# Altium project eBox_4G_SIM7600.PrjPcb
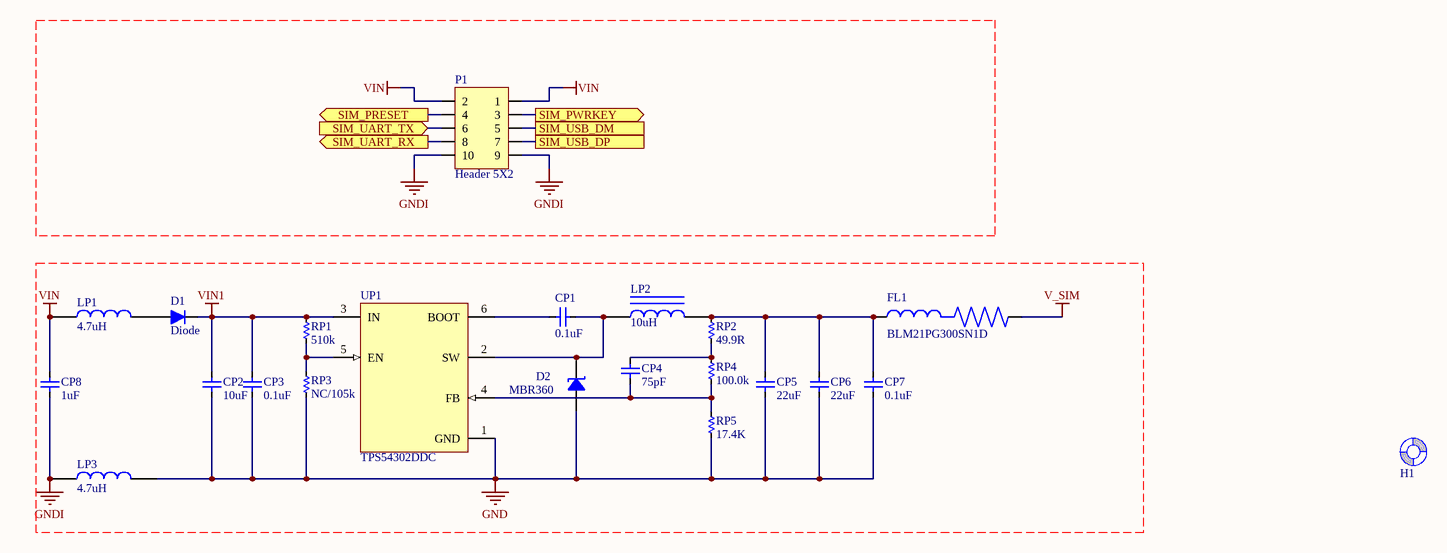
[diagram p0: eBox_4G_REG.schdoc]
Version: 2.1; Hash: R942R9Z6
2 sheets, 81 parts. Net scope: flat (ports and power ports of the same name join across sheets).
Board file: eBox_4G_SIM7600.PcbDoc
Sheets:
  eBox_4G_REG.schdoc
  eBox_4G_SIM.SchDoc

## Sheet eBox_4G_REG.schdoc: car_logger_fona_reg
size A4; DocumentNumber: 3; SheetNumber: 3; SheetTotal: 3

### Parts
CP1  0.1uF  [CC 0603]
CP2  10uF  [CC 0805]
CP3  0.1uF  [CC 0603]
CP4  75pF  [CC 0603]
CP5  22uF  [CC 0805]
CP6  22uF  [CC 0805]
CP7  0.1uF  [CC 0603]
CP8  1uF  [CC 0805]
D1  Diode  [DO-214AC (SMA) L]
D2  MBR360  [SMF DO-219AB]
FL1  BLM21PG300SN1D  [L 0805 (2012)]
H1  Screw Hole  [SCREW/2.8M/5M]  (value not drawn)  (no BOM)
LP1  4.7uH  [0805]
LP2  10uH  [IND_MWSA0518_525418]
LP3  4.7uH  [0805]
P1  Header 5X2  [HDR/Header/10/DL]
RP1  510k  [RR 0603]
RP2  49.9R  [RR 0603]
RP3  NC/105k  [RR 0603]
RP4  100.0k  [RR 0603]
RP5  17.4K  [RR 0603]
UP1  TPS54302DDC  [SOT-23-6]

### Ports
SIM_PRESET (out), SIM_PWRKEY (out), SIM_UART_RX (out), SIM_UART_TX (in), SIM_USB_DM, SIM_USB_DP

### Nets
GND: CP2.2 CP3.2 CP5.2 CP6.2 CP7.2 D2.1 LP3.2 RP3.1 RP5.2 UP1.1(GND)
GNDI: CP8.2 LP3.1 P1.9 P1.10
V_SIM: FL1.2
VIN: CP8.1 LP1.1 P1.1 P1.2
VIN1: CP2.1 CP3.1 D1.2(K) RP1.2 UP1.3(IN)
SIM_PRESET: P1.4 ; port SIM_PRESET
SIM_PWRKEY: P1.3 ; port SIM_PWRKEY
SIM_UART_RX: P1.8 ; port SIM_UART_RX
SIM_UART_TX: P1.6 ; port SIM_UART_TX
SIM_USB_DM: P1.5 ; port SIM_USB_DM
SIM_USB_DP: P1.7 ; port SIM_USB_DP
NetCP1_1: CP1.1 UP1.6(BOOT)
NetCP1_2: CP1.2 D2.2 LP2.1 UP1.2(SW)
NetCP4_1: CP4.1 RP2.2 RP4.1
NetCP4_2: CP4.2 RP4.2 RP5.1 UP1.4(FB)
NetCP5_1: CP5.1 CP6.1 CP7.1 FL1.1 LP2.2 RP2.1
NetD1_1: D1.1(A) LP1.2
NetRP1_1: RP1.1 RP3.2 UP1.5(EN)

Not connected (* = marked no-connect by the designer): H1 1(Screw)

### Notes on the sheet
- Title
- Size:
- Date:
- A4
- Number:
- Time:
- Revision:
- Sheet
- of
- NPN
- Lab
- File:

### Library data of the parts
CP1 CP3 CP7 = Capacitor NP: CAP CER 0.1UF 16V X7R 0603; Manufacturer: Murata Electronics; Manufacturer Part Number: GCJ188R71C104KA01D; Supplier 1: Digi-Key; Supplier Part Number 1: 490-5796-2-ND; Termination Style: SMD/SMT; Package: 0603 (1608 Metric)
CP2 CP8 = Capacitor NP: CAP CER 10UF 25V X5R 0805; Manufacturer: Murata Electronics; Manufacturer Part Number: GRM21BR61E106MA73L; Supplier 1: Digi-Key; Supplier Part Number 1: 490-10748-2-ND; Termination Style: SMD/SMT; Package: 0805 (2012 Metric)
CP4 = Capacitor NP: CAP CER 75PF 50V C0G/NP0 0603; Manufacturer: Murata Electronics; Manufacturer Part Number: GRM1885C1H750JA01D; Supplier 1: Digi-Key; Supplier Part Number 1: 490-1424-1-ND; Termination Style: SMD/SMT; Package: 0603 (1608 Metric)
CP5 CP6 = Capacitor NP: CAP CER 22UF 25V X5R 0805; Manufacturer: Murata Electronics; Manufacturer Part Number: GRM21BR61E226ME44L; Supplier 1: Digi-Key; Supplier Part Number 1: 490-10749-2-ND; Termination Style: SMD/SMT; Package: 0805 (2012 Metric)
D1 = Diode: Default Diode
D2 = VTVS58ASMF-HM3-08: TVS DIODE 57.6V 98V DO219AB; Manufacturer: Vishay Semiconductor Diodes Division; Capacitance @ Frequency: 245pF @ 1MHz; Current - Peak Pulse (10/1000µs): 3.89A; Power Line Protection: No; Power - Peak Pulse: 400W; Type: DO-219AB; Unidirectional Channels: 1; Voltage - Breakdown (Min): 64.6V; Part Number: VTVS58ASMF-HM3-08; Applications: Automotive; ComponentLink1Description: Datasheet; ComponentLink1URL: http://www.vishay.com/docs/85891/vtvs3v3asmf.pdf; ComponentLink2Description: DigiKey Link; ComponentLink2URL: http://digikey.com/product-detail/en/vishay-semiconductor-diodes-division/VTVS58ASMF-HM3-08/112-VTVS58ASMF-HM3-08CT-ND/11562600; Device Package: DO-219AB; LastUpdated: 3/21/2020 12:56:09 AM; Lifecycle Status: Active; Minimum Order: 0; Mounting Type: Surface Mount; Operating Temperature: -55°C ~ 175°C (TJ); Package / Case: DO-219AB; Packaging: TapeAndReel; PartId: 5476; Part Status: -55°C ~ 175°C (TJ); Price: 0.10; Series: Automotive, AEC-Q101, TransZorb®; Supplier 1: DigiKey; Supplier Part Number 1: 112-VTVS58ASMF-HM3-08CT-ND; Supplier Device Package: DO-219AB (SMF); Voltage - Clamping (Max) @ Ipp: 98V; Voltage - Reverse Standoff (Typ): 57.6V
FL1 = BLM21PG300SN1D: 30 Ohms @ 100MHz 1 Power Line Ferrite Bead 0805 _2012 Metric_ 4A 14mOhm; MF: Murata; Value: *; MP: BLM21PG300SN1D; Package: 2012 Murata; SnapEDA_Link: https://www.snapeda.com/parts/BLM21PG300SN1D/Murata/view-part/214335/?ref=snap; Digi-Key_Part_Number: 490-1052-1-ND; Digi-Key_Purchase_URL: https://www.digikey.com/product-detail/en/murata-electronics/BLM21PG300SN1D/490-1052-1-ND/584499?utm_source=snapeda&utm_medium=aggregator&utm_campaign=symbol
LP1 LP3 = Inductor: Manufacturer: *; Manufacturer Part No: *; Component Type: Inductor; Value: *; Order Code: *; Supplier: *
LP2 = Inductor Power: Fixed Inductors 10uH 20% Low Profile; Manufacturer: Sunlord; Manufacturer Part Number: MWSA0518-100MT; Termination Style: SMD/SMT; Package: 5254
P1 = Header 5X2: Header, 5-Pin, Dual row
RP1 = Resistors: RES SMD 510K OHM 1% 1/10W 0603; Manufacturer: Panasonic Industrial Devices; Manufacturer Part Number: ERJ-3EKF5103V; Supplier 1: Digi-Key; Supplier Part Number 1: P510KHCT-ND; Termination Style: SMD/SMT; Package: 0603 (1608 Metric)
RP2 = Resistors: RES SMD 49.9 OHM 1% 1/10W 0603; Manufacturer: Panasonic Industrial Devices; Manufacturer Part Number: ERJ-3EKF49R9V; Supplier 1: Digi-Key; Supplier Part Number 1: P49.9HTR-ND; Termination Style: SMD/SMT; Package: 0603 (1608 Metric)
RP3 = Resistors: RES SMD 105K OHM 1% 1/10W 0603; Manufacturer: Panasonic Industrial Devices; Manufacturer Part Number: ERJ-3EKF1053V; Supplier 1: Digi-Key; Supplier Part Number 1: P105KHCT-ND; Termination Style: SMD/SMT; Package: 0603 (1608 Metric)
RP4 = Resistors: RES SMD 100K OHM 1% 1/10W 0603; Manufacturer: Panasonic Industrial Devices; Manufacturer Part Number: ERJ-3EKF1003V; Supplier 1: Digi-Key; Supplier Part Number 1: P100KHCT-ND; Termination Style: SMD/SMT; Package: 0603 (1608 Metric)
RP5 = Resistors: RES SMD 17.4K OHM 1% 1/10W 0603; Manufacturer: Panasonic Industrial Devices; Manufacturer Part Number: ERJ-3EKF1742V; Supplier 1: Digi-Key; Supplier Part Number 1: P17.4KHTR-ND; Termination Style: SMD/SMT; Package: 0603 (1608 Metric)
UP1 = TPS56339: IC REG BUCK ADJ 3A TSOT23-6; Manufacturer: Texas Instruments; Manufacturer Part Number: TPS54302DDCR; Package: SOT-23-6; Supplier 1: Digi-Key; Supplier Part Number 1: 296-46237-1-ND; Termination Style: SMD/SMT

## Sheet eBox_4G_SIM.SchDoc
size B
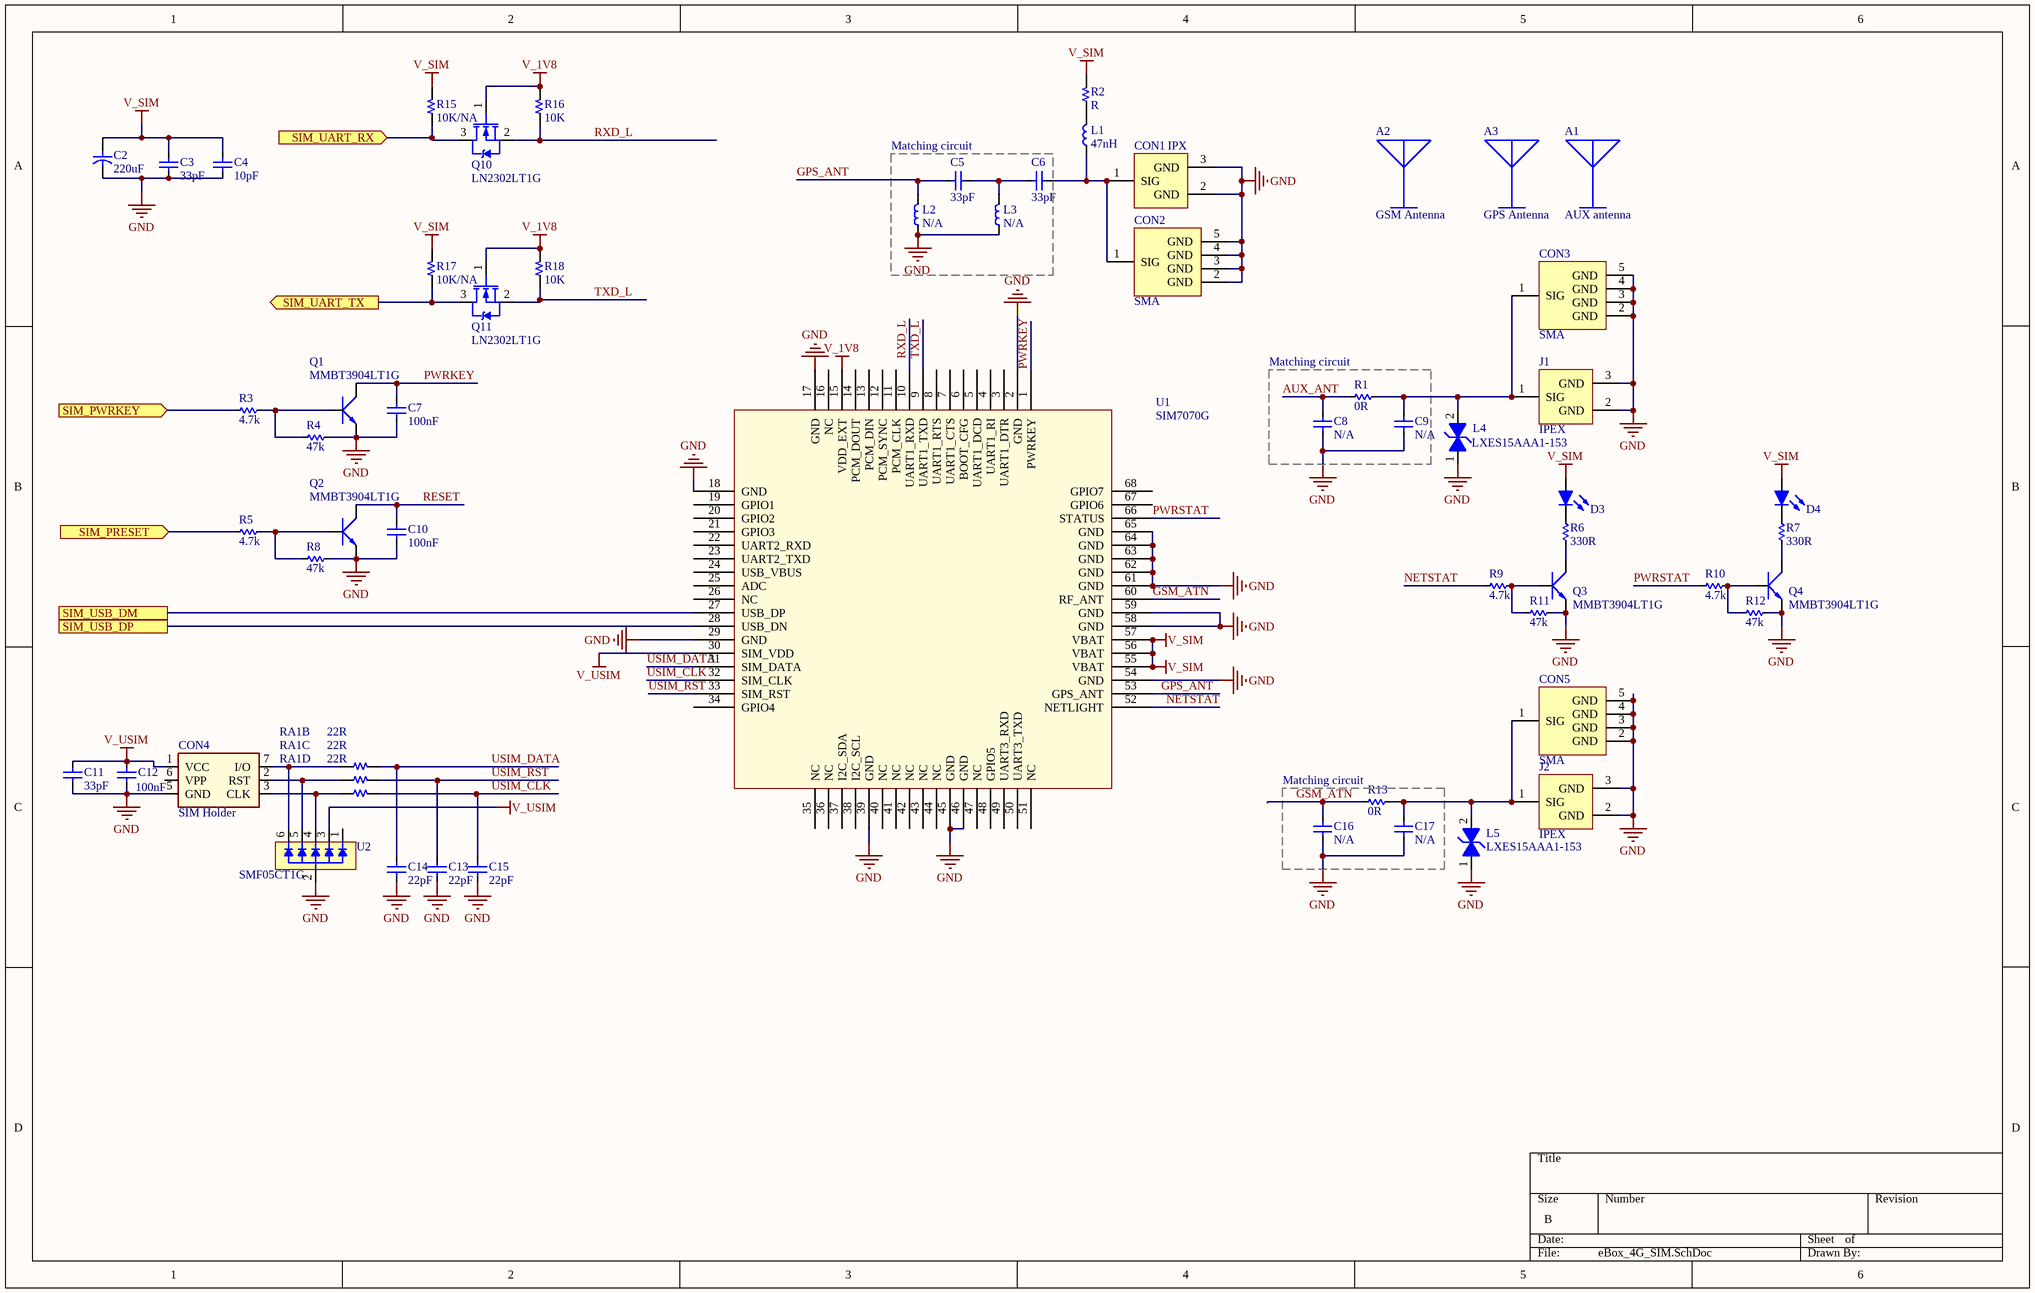
[diagram p1: eBox_4G_SIM.SchDoc]

### Parts
A1  AUX antenna  [Antenna]
A2  GSM Antenna  [Antenna]
A3  GPS Antenna  [Antenna]
C2  220uF  [C SMD ALU (D8)]
C3  33pF  [CC 0603]
C4  10pF  [CC 0603]
C5  33pF  [CC 0603]
C6  33pF  [CC 0603]
C7  100nF  [CC 0603]
C8  N/A  [CC 0603]
C9  N/A  [CC 0603]
C10  100nF  [CC 0603]
C11  33pF  [CC 0603]
C12  100nF  [CC 0603]
C13  22pF  [CC 0603]
C14  22pF  [CC 0603]
C15  22pF  [CC 0603]
C16  N/A  [CC 0603]
C17  N/A  [CC 0603]
CON1  IPX  [CONN/IPX/SMD]
CON2  SMA  [CONN/SMA/RA]
CON3  SMA  [CONN/SMA/RA]
CON4  SIM Holder  [CON SIM Holder C707]
CON5  SMA  [CONN/SMA/RA]
D3  LED GREEN  [Led 0603 - green]  (value not drawn)
D4  LED RED  [Led 0603 - red]  (value not drawn)
J1  IPEX  [CONN/IPX/SMD]
J2  IPEX  [CONN/IPX/SMD]
L1  47nH  [L 0603 (1608)]
L2  N/A  [LL 0603]
L3  N/A  [LL 0603]
L4  LXES15AAA1-153  [C 0603]
L5  LXES15AAA1-153  [C 0603]
Q1  MMBT3904LT1G  [SOT-23]
Q2  MMBT3904LT1G  [SOT-23]
Q3  MMBT3904LT1G  [SOT-23]
Q4  MMBT3904LT1G  [SOT-23]
Q10  LN2302LT1G  [SOT-23]
Q11  LN2302LT1G  [SOT-23]
R1  0R  [RR 0603]
R2  R  [R 0603]
R3  4.7k  [RR 0603]
R4  47k  [RR 0603]
R5  4.7k  [RR 0603]
R6  330R  [RR 0603]
R7  330R  [RR 0603]
R8  47k  [RR 0603]
R9  4.7k  [RR 0603]
R10  4.7k  [RR 0603]
R11  47k  [RR 0603]
R12  47k  [RR 0603]
R13  0R  [RR 0603]
R15  10K/NA  [R 0603]
R16  10K  [R 0603]
R17  10K/NA  [R 0603]
R18  10K  [R 0603]
RA1  22R  [RAx4 1206 (3216)]  (parts B,C,D of 4)
U1  SIM7070G  [SIM7070]
U2  SMF05CT1G  [SOT-363-6]

### Blocks framed on the sheet
Matching circuit: C5 C6 L2 L3
Matching circuit: C8 C9 R1
Matching circuit: C16 C17 R13

### Ports
SIM_PRESET (in), SIM_PWRKEY (in), SIM_UART_RX (in), SIM_UART_TX (out), SIM_USB_DM, SIM_USB_DP

### Nets
GND: C2.2 C3.1 C4.1 C7.2 C8.1 C9.1 C10.2 C11.2 C12.2 C13.2 C14.2 C15.2 C16.1 C17.1 CON1.2(GND) CON1.3(GND) CON2.2(GND) CON2.3(GND) CON2.4(GND) CON2.5(GND) CON3.2(GND) CON3.3(GND) CON3.4(GND) CON3.5(GND) CON4.5(GND) CON5.2(GND) CON5.3(GND) CON5.4(GND) CON5.5(GND) J1.2(GND) J1.3(GND) J2.2(GND) J2.3(GND) L2.1 L3.1 L4.1 L5.1 Q1.2(E) Q2.2(E) Q3.2(E) Q4.2(E) R4.2 R8.2 R11.2 R12.2 U1.2(GND) U1.17(GND) U1.18(GND) U1.29(GND) U1.39(GND) U1.45(GND) U1.46(GND) U1.54(GND) U1.58(GND) U1.59(GND) U1.61(GND) U1.62(GND) U1.63(GND) U1.64(GND) U1.65(GND) U2.2(A)
V_1V8: Q10.1(G) Q11.1(G) R16.2 R18.2 U1.15(VDD_EXT)
V_SIM: C2.1 C3.2 C4.2 D3.1(A) D4.1(A) R2.2 R15.2 R17.2 U1.55(VBAT) U1.56(VBAT) U1.57(VBAT)
V_USIM: C11.1 C12.1 CON4.1(VCC) U1.30(SIM_VDD) U2.3(K3)
AUX_ANT: C8.2 R1.2
GPS_ANT: C5.2 L2.2 U1.53(GPS_ANT)
GSM_ATN: C16.2 R13.2 U1.60(RF_ANT)
NETSTAT: R9.1 U1.52(NETLIGHT)
PWRKEY: C7.1 Q1.3(C) U1.1(PWRKEY)
PWRSTAT: R10.1 U1.66(STATUS)
RESET: C10.1 Q2.3(C)
RXD_L: Q10.2(S) R16.1 U1.10(UART1_RXD)
SIM_PRESET: R5.1 ; port SIM_PRESET
SIM_PWRKEY: R3.1 ; port SIM_PWRKEY
SIM_UART_RX: Q10.3(D) R15.1 ; port SIM_UART_RX
SIM_UART_TX: Q11.3(D) R17.1 ; port SIM_UART_TX
SIM_USB_DM: U1.27(USB_DP) ; port SIM_USB_DM
SIM_USB_DP: U1.28(USB_DN) ; port SIM_USB_DP
TXD_L: Q11.2(S) R18.1 U1.9(UART1_TXD)
USIM_CLK: C15.1 RA1.5 U1.32(SIM_CLK)
USIM_DATA: C14.1 RA1.7 U1.31(SIM_DATA)
USIM_RST: C13.1 RA1.6 U1.33(SIM_RST)
NetC5_1: C5.1 C6.2 L3.2
NetC6_1: C6.1 CON1.1(SIG) CON2.1(SIG) L1.1
NetC9_2: C9.2 CON3.1(SIG) J1.1(SIG) L4.2 R1.1
NetC17_2: C17.2 CON5.1(SIG) J2.1(SIG) L5.2 R13.1
NetCON4_2: CON4.2(RST) RA1.3 U2.5(K5)
NetCON4_3: CON4.3(CLK) RA1.4 U2.4(K4)
NetCON4_7: CON4.7(I/O) RA1.2 U2.6(K6)
NetD3_2: D3.2(K) R6.2
NetD4_2: D4.2(K) R7.2
NetL1_2: L1.2 R2.1
NetQ1_1: Q1.1(B) R3.2 R4.1
NetQ2_1: Q2.1(B) R5.2 R8.1
NetQ3_1: Q3.1(B) R9.2 R11.1
NetQ3_3: Q3.3(C) R6.1
NetQ4_1: Q4.1(B) R10.2 R12.1
NetQ4_3: Q4.3(C) R7.1

Not connected (* = marked no-connect by the designer): CON4 6(VPP); U1 3(UART1_DTR) 4(UART1_RI) 5(UART1_DCD) 6(BOOT_CFG) 7(UART1_CTS) 8(UART1_RTS) 11(PCM_CLK) 12(PCM_SYNC) 13(PCM_DIN) 14(PCM_DOUT) 16(NC) 19(GPIO1) 20(GPIO2) 21(GPIO3) 22(UART2_RXD) 23(UART2_TXD) 24(USB_VBUS) 25(ADC) 26(NC) 34(GPIO4) 35(NC) 36(NC) 37(I2C_SDA) 38(I2C_SCL) 40(NC) 41(NC) 42(NC) 43(NC) 44(NC) 47(NC) 48(GPIO5) 49(UART3_RXD) 50(UART3_TXD) 51(NC) 67(GPIO6) 68(GPIO7); U2 1(K1)

### Library data of the parts
A1-A3 = Antenna
C2 = Capacitor: CAP TANT POLY 100UF 6.3V 1210; Manufacturer: AVX Corporation; Manufacturer Part Number: TCJB107M006R0055; Package: 1210 (3528 Metric); Supplier 1: Digi-Key; Supplier Part Number 1: 478-9410-2-ND; Termination Style: SMD/SMT
C3 C5 C6 C11 C13-C15 = Capacitor NP: CAP CER 33PF 100V C0G/NP0 0603; Manufacturer: Murata Electronics; Manufacturer Part Number: GCM1885C2A330JA16D; Supplier 1: Digi-Key; Supplier Part Number 1: 490-4943-2-ND; Termination Style: SMD/SMT; Package: 0603 (1608 Metric)
C4 = Capacitor NP: CAP CER 10PF 100V C0G/NP0 0603; Manufacturer: Murata Electronics; Manufacturer Part Number: GCM1885C2A100JA16D; Supplier 1: Digi-Key; Supplier Part Number 1: 490-4770-2-ND; Termination Style: SMD/SMT; Package: 0603 (1608 Metric)
C7 C10 C12 = Capacitor NP: as CP1 on sheet eBox_4G_REG; Supplier 1: Digi-Key; Supplier Part Number 1: 490-5796-2-ND; Termination Style: SMD/SMT; Package: 0603 (1608 Metric)
C8 C9 C16 C17 = Capacitor NP: CAP N/A; Supplier 1: Digi-Key; Termination Style: SMD/SMT; Package: 0603 (1608 Metric)
CON1 = CON IPX
CON2 CON3 CON5 = CON SMA: SMA connectors
CON4 = SIM holder 6 pin: SIM Card holder, 6 pins
D3 = Led: LED GREEN DIFFUSED 0603 SMD; Manufacturer: Rohm Semiconductor; Manufacturer Part Number: SML-D12P8WT86; Package: 0603 (1608 Metric); Supplier 1: Digi-Key; Supplier Part Number 1: 511-1579-2-ND; Termination Style: SMD/SMT
D4 = Led: LED RED DIFFUSED 0603 SMD; Manufacturer: Rohm Semiconductor; Manufacturer Part Number: SML-D12U8WT86; Package: 0603 (1608 Metric); Supplier 1: Digi-Key; Supplier Part Number 1: 511-1580-2-ND; Termination Style: SMD/SMT
J1 J2 = CON IPX: CONN UMC RCPT STR 50 OHM SMD; Manufacturer: Taoglas Limited; Manufacturer Part Number: RECE.20279.001E.01; Supplier 1: Digi-Key; Supplier Part Number 1: 931-1107-1-ND; Termination Style: SMD/SMT
L1 = Inductor
L2 L3 = Inductor: IND N/A; Supplier 1: Digi-Key; Termination Style: SMD/SMT; Package: 0603 (1608 Metric)
L4 L5 = LXES15AAA1-153: Clamp Ipp Tvs Diode Surface Mount 1005; MF: Murata; SnapEDA_Link: https://www.snapeda.com/parts/LXES15AAA1-153/Murata%20Electronics%20North%20America/view-part/653473/?ref=snap; MP: LXES15AAA1-153; Value: *; Digi-Key_Part_Number: 490-13210-1-ND; Digi-Key_Purchase_URL: https://www.digikey.kr/product-detail/en/murata-electronics/LXES15AAA1-153/490-13210-1-ND/5843764?utm_source=snapeda&utm_medium=aggregator&utm_campaign=symbol; Package: 0402 Murata
Q1-Q4 = MMBT3904LT1G: TRANS NPN 40V 0.2A SOT23; Manufacturer: ON Semiconductor; Supplier 1: Digi-Key; Supplier Part Number 1: MMBT3904LT1GOSCT-ND; Manufacturer Part Number: MMBT3904LT1G; Package: SOT-23-3 (TO-236); Termination Style: SMD/SMT
Q10 Q11 = Mosfet N
R1 R13 = Resistors: RES SMD 0 OHM JUMPER 1/10W 0603; Manufacturer: Panasonic Industrial Devices; Manufacturer Part Number: ERJ-3GEY0R00V; Supplier 1: Digi-Key; Supplier Part Number 1: P0.0GTR-ND; Termination Style: SMD/SMT; Package: 0603 (1608 Metric)
R2 R15-R18 = Resistor
R3 R5 R9 R10 = Resistors: RES SMD 4.7K OHM 1% 1/10W 0603; Manufacturer: Panasonic Industrial Devices; Manufacturer Part Number: ERJ-3EKF4701V; Supplier 1: Digi-Key; Supplier Part Number 1: P4.70KHTR-ND; Termination Style: SMD/SMT; Package: 0603 (1608 Metric)
R4 R8 R11 R12 = Resistors: RES SMD 47K OHM 5% 1/10W 0603; Manufacturer: Panasonic Industrial Devices; Manufacturer Part Number: ERJ-3GEYJ473V; Supplier 1: Digi-Key; Supplier Part Number 1: P47KGTR-ND; Termination Style: SMD/SMT; Package: 0603 (1608 Metric)
R6 R7 = Resistors: RES SMD 330 OHM 5% 1/10W 0603; Manufacturer: Panasonic Industrial Devices; Manufacturer Part Number: ERJ-3GEYJ331V; Supplier 1: Digi-Key; Supplier Part Number 1: P330GTR-ND; Termination Style: SMD/SMT; Package: 0603 (1608 Metric)
RA1 = Resistor Array x4
U2 = SMF05C: TVS DIODE 5V 12.5V SC88; Manufacturer: ON Semiconductor; Manufacturer Part Number: SMF05CT1G; Package: 6-TSSOP, SC-88, SOT-363; Supplier 1: Digi-Key; Supplier Part Number 1: SMF05CT1GOSCT-ND; Termination Style: SMD/SMT

## Nets that join several sheets
GND: eBox_4G_REG (10 pins), eBox_4G_SIM (61 pins)
V_SIM: eBox_4G_REG (FL1.2), eBox_4G_SIM (11 pins)
SIM_PRESET: eBox_4G_REG (P1.4), eBox_4G_SIM (R5.1)
SIM_PWRKEY: eBox_4G_REG (P1.3), eBox_4G_SIM (R3.1)
SIM_UART_RX: eBox_4G_REG (P1.8), eBox_4G_SIM (Q10.3 R15.1)
SIM_UART_TX: eBox_4G_REG (P1.6), eBox_4G_SIM (Q11.3 R17.1)
SIM_USB_DM: eBox_4G_REG (P1.5), eBox_4G_SIM (U1.27)
SIM_USB_DP: eBox_4G_REG (P1.7), eBox_4G_SIM (U1.28)